# EAGLE schematic GB_Controller (EAGLE 6.6.0)
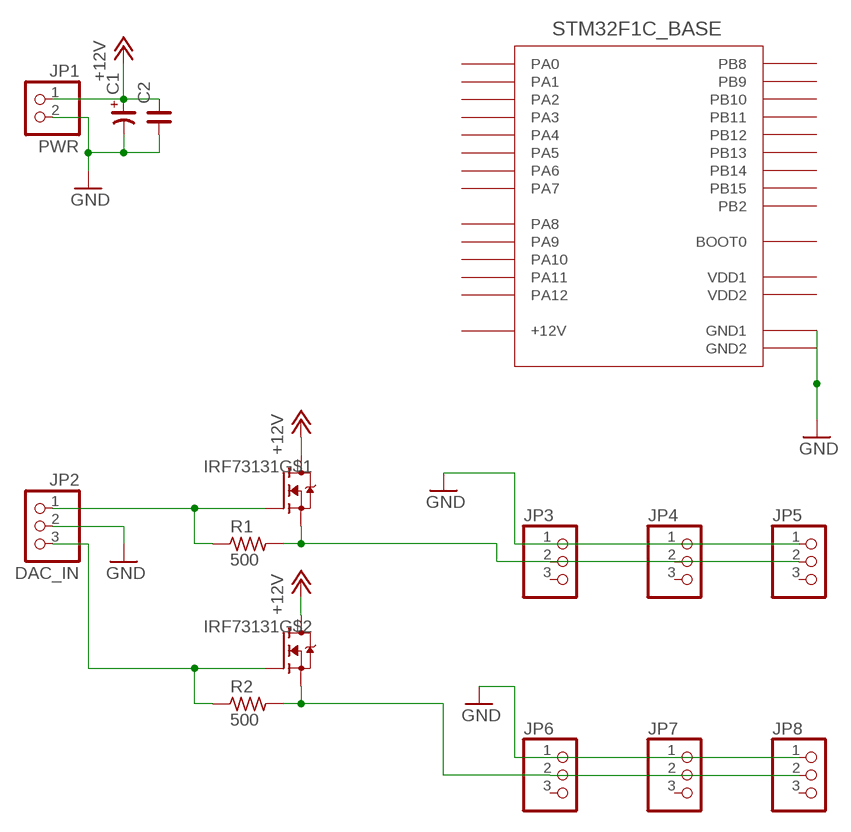
[diagram p0: schematic, sheet 1]

## Parts
C1  CP_7343  [C7343/T]
C2  C_0603  [C0603]
IRF73131  IRF7313  [SO-8]
JP1  PWR  PINHD-1X02_2.54-S  [1X02-S]
JP2  DAC_IN  PINHD-1X03_2.54-S  [1X03-S]
JP3  PINHD-1X03_2.54-S  [1X03-S]
JP4  PINHD-1X03_2.54-S  [1X03-S]
JP5  PINHD-1X03_2.54-S  [1X03-S]
JP6  PINHD-1X03_2.54-S  [1X03-S]
JP7  PINHD-1X03_2.54-S  [1X03-S]
JP8  PINHD-1X03_2.54-S  [1X03-S]
R1  500  R_1206  [R1206]
R2  500  R_1206  [R1206]
STM32F1C_BASE1  STM32F1C_BASE  [STM32F1_BASE]

## Nets
+12V: C1.+ C2.2 IRF73131.5(D) IRF73131.6(D) IRF73131.7(D) IRF73131.8(D) JP1.1
GND: C1.- C2.1 JP1.2 JP2.2 JP3.1 JP4.1 JP5.1 JP6.1 JP7.1 JP8.1 STM32F1C_BASE1.GND1(GND2) STM32F1C_BASE1.GND(GND1)
N$1: IRF73131.1(S) JP3.2 JP4.2 JP5.2 R1.2
N$2: IRF73131.4(G) JP2.3 R2.1
N$3: IRF73131.2(G) JP2.1 R1.1
N$5: IRF73131.3(S) JP6.2 JP7.2 JP8.2 R2.2
Unconnected: JP3.3 JP4.3 JP5.3 JP6.3 JP7.3 JP8.3 STM32F1C_BASE1.3.3(VDD1) STM32F1C_BASE1.3.3_1(VDD2) STM32F1C_BASE1.B2 STM32F1C_BASE1.BOOT0 STM32F1C_BASE1.PA0 STM32F1C_BASE1.PA1 STM32F1C_BASE1.PA2 STM32F1C_BASE1.PA3 STM32F1C_BASE1.PA4 STM32F1C_BASE1.PA5 STM32F1C_BASE1.PA6 STM32F1C_BASE1.PA7 STM32F1C_BASE1.PA8 STM32F1C_BASE1.PA9 STM32F1C_BASE1.PA10 STM32F1C_BASE1.PA11 STM32F1C_BASE1.PA12 STM32F1C_BASE1.PB8 STM32F1C_BASE1.PB9 STM32F1C_BASE1.PB10 STM32F1C_BASE1.PB11 STM32F1C_BASE1.PB12 STM32F1C_BASE1.PB13 STM32F1C_BASE1.PB14 STM32F1C_BASE1.PB15

## Power pins joined to a net without a drawn wire
+12V: STM32F1C_BASE1.+12(+12V)

## Library data of the parts
C1 = rc-master-smd:CP_: POLARIZED CAP
C2 = rc-master-smd:C_: NON-POLARIZED CAP
IRF73131 = my-library:IRF7313
JP1 = pinhead-2:PINHD-1X02: PIN HEADER
JP2-JP8 = pinhead-2:PINHD-1X03: PIN HEADER
R1 R2 = rc-master-smd:R_: RESISTOR
STM32F1C_BASE1 = my-library:STM32F1C_BASE: STM32F100C8 Base Board